# Altium schematic sheet NBT_UIO_INT.SCHDOC
size A4; Organization: Altium Limited; Address1: L3, 12a Rodborough Rd; Address2: Frenchs Forest; Address3: NSW; Address4: Australia 2086; DocumentNumber: 8; SheetNumber: 8; SheetTotal: 12
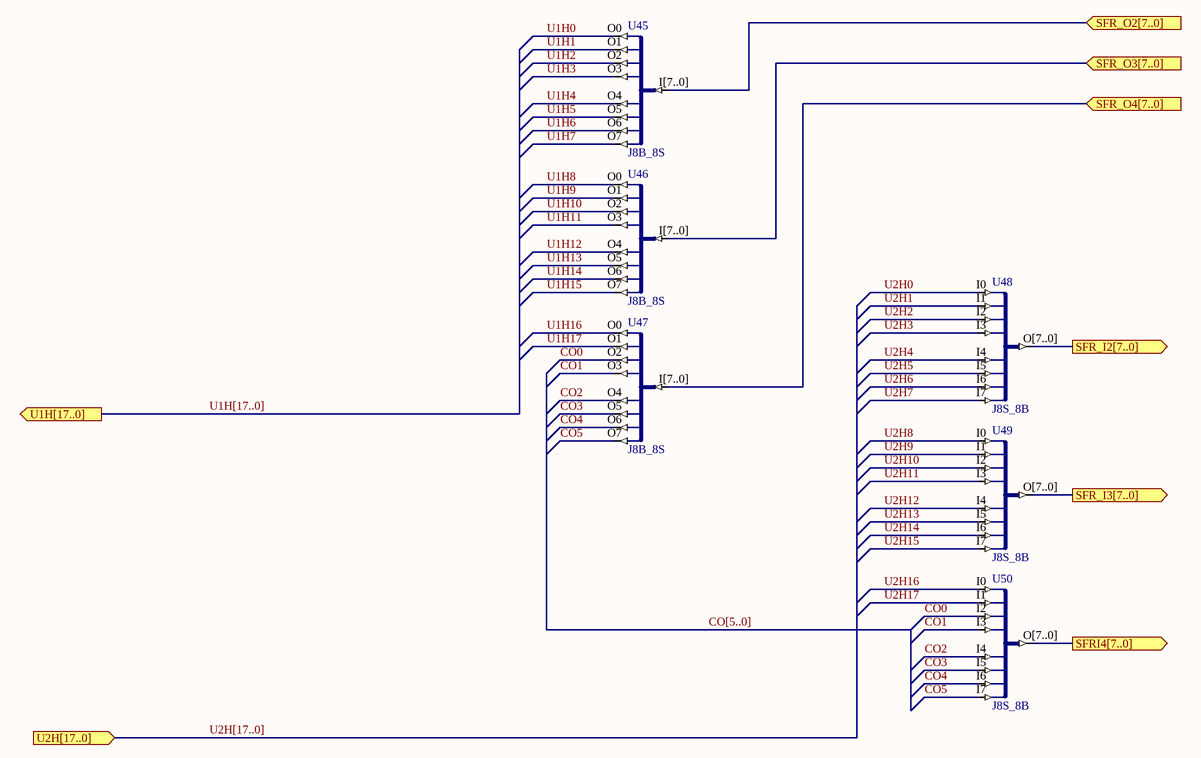
[diagram p0: NBT_UIO_INT.SCHDOC]

## Parts
U45  J8B_8S
U46  J8B_8S
U47  J8B_8S
U48  J8S_8B
U49  J8S_8B
U50  J8S_8B

## Ports
SFR_I2[7..0] (out), SFR_I3[7..0] (out), SFR_O2[7..0] (in), SFR_O3[7..0] (in), SFR_O4[7..0] (in), SFRI4[7..0] (out), U1H[17..0] (out), U2H[17..0] (in)

## Nets
CO0: U47.O2 U50.I2
CO1: U47.O3 U50.I3
CO2: U47.O4 U50.I4
CO3: U47.O5 U50.I5
CO4: U47.O6 U50.I6
CO5: U47.O7 U50.I7
SFR_I2[7..0]: U48.O[7..0] ; port SFR_I2[7..0]
SFR_I3[7..0]: U49.O[7..0] ; port SFR_I3[7..0]
SFR_O2[7..0]: U45.I[7..0] ; port SFR_O2[7..0]
SFR_O3[7..0]: U46.I[7..0] ; port SFR_O3[7..0]
SFR_O4[7..0]: U47.I[7..0] ; port SFR_O4[7..0]
SFRI4[7..0]: U50.O[7..0] ; port SFRI4[7..0]
U1H0: U45.O0
U1H1: U45.O1
U1H2: U45.O2
U1H3: U45.O3
U1H4: U45.O4
U1H5: U45.O5
U1H6: U45.O6
U1H7: U45.O7
U1H8: U46.O0
U1H9: U46.O1
U1H10: U46.O2
U1H11: U46.O3
U1H12: U46.O4
U1H13: U46.O5
U1H14: U46.O6
U1H15: U46.O7
U1H16: U47.O0
U1H17: U47.O1
U2H0: U48.I0
U2H1: U48.I1
U2H2: U48.I2
U2H3: U48.I3
U2H4: U48.I4
U2H5: U48.I5
U2H6: U48.I6
U2H7: U48.I7
U2H8: U49.I0
U2H9: U49.I1
U2H10: U49.I2
U2H11: U49.I3
U2H12: U49.I4
U2H13: U49.I5
U2H14: U49.I6
U2H15: U49.I7
U2H16: U50.I0
U2H17: U50.I1

## Buses and harness runs
bus CO[5..0]
bus U1H[17..0] = port U1H[17..0]
bus U2H[17..0] = port U2H[17..0]

## Notes on the sheet
- Title
- Size:
- Date:
- A4
- Number:
- Time:
- Revision:
- Sheet
- of
- File:

## Library data of the parts
U45-U47 = J8B_8S: 8-Bit input bus to 8 single pin outputs; ArchiveName: GENERIC; Published: 7-Nov-2003; Publisher: Altium Limited; Core Revision: 1.00.00
U48-U50 = J8S_8B: 8 Single pin inputs to single 8-Bit output bus; ArchiveName: GENERIC; Published: 7-Nov-2003; Publisher: Altium Limited; Core Revision: 1.00.00